# Altium project MiniPC MB GOST.PrjPcb (part 9 of 31)

## Sheet Supply Swithes 2V5-1V8.SchDoc
size 209 x 297 mm; Author: ALTIUM GOSTBOM2.0 KEV; SheetNumber: 46; SheetTotal: 48
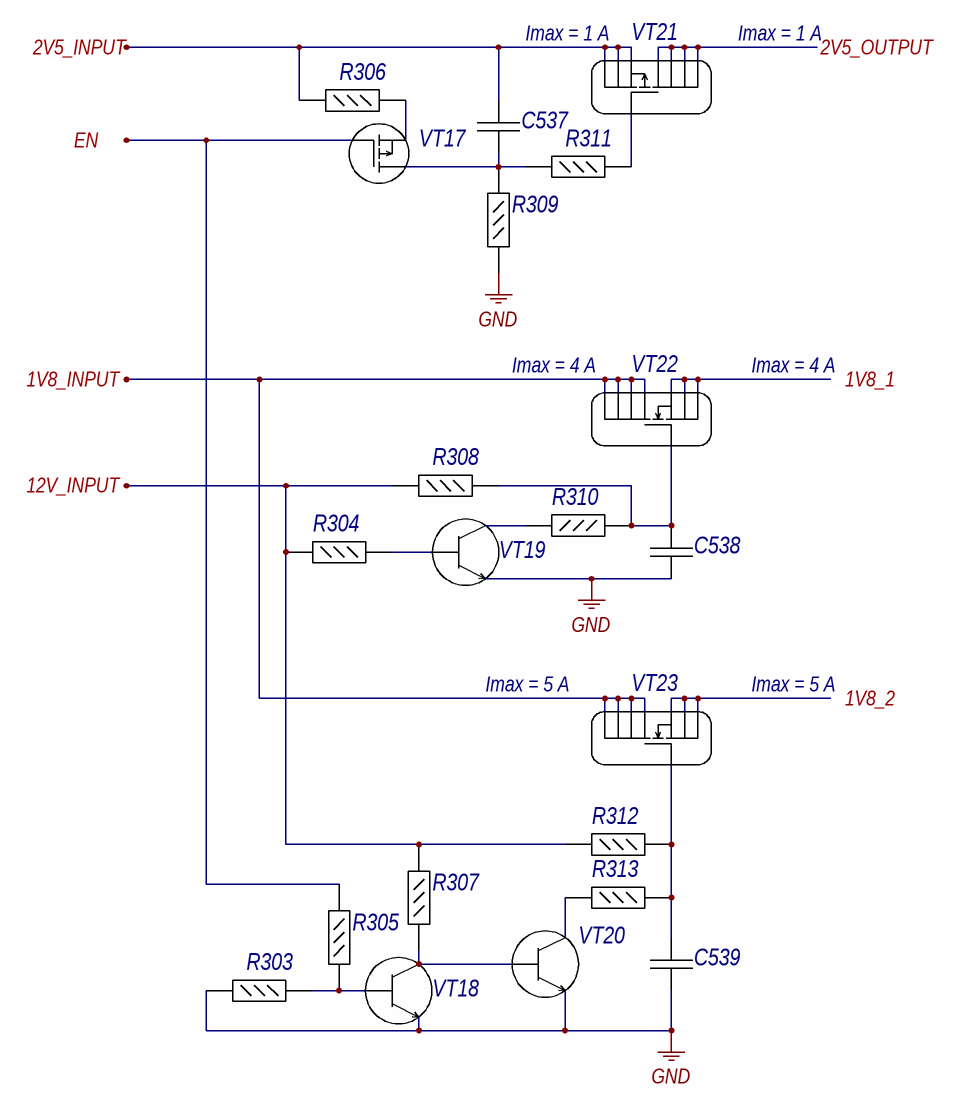
[diagram p11: Supply Swithes 2V5-1V8.SchDoc]

### Parts
C537  CGB2A1X5R1E105K033BC  [CAPC1005X33X10LL5]  (value not drawn)
C538  GRM155R71H103KA88D  [CAPC1005X55X25ML05T10]  (value not drawn)
C539  GRM155R71H103KA88D  [CAPC1005X55X25ML05T10]  (value not drawn)
R303  ERJ-2RKF1002X  [RESC1005X40X25LL05T05]  (value not drawn)
R304  ERJ-2RKF1003X  [RESC1005X40X25LL05T05]  (value not drawn)
R305  ERJ-2RKF1002X  [RESC1005X40X25LL05T05]  (value not drawn)
R306  ERJ-2RKF10R0X  [RESC1005X40X25LL05T05]  (value not drawn)
R307  ERJ-2RKF1003X  [RESC1005X40X25LL05T05]  (value not drawn)
R308  ERJ-2RKF1003X  [RESC1005X40X25LL05T05]  (value not drawn)
R309  ERJ-2RKF4992X  [RESC1005X40X25LL05T05]  (value not drawn)
R310  ERJ-2RKF1001X  [RESC1005X40X25LL05T05]  (value not drawn)
R311  ERJ-2RKF10R0X  [RESC1005X40X25LL05T05]  (value not drawn)
R312  ERJ-2RKF1003X  [RESC1005X40X25LL05T05]  (value not drawn)
R313  ERJ-2RKF1001X  [RESC1005X40X25LL05T05]  (value not drawn)
VT17  DMG2305UX-7  [DIOD-SOT23-3_A_V]  (value not drawn)
VT18  MMBT2222A-7-F  [DIOD-SOT23-3_V]  (value not drawn)
VT19  MMBT2222A-7-F  [DIOD-SOT23-3_V]  (value not drawn)
VT20  MMBT2222A-7-F  [DIOD-SOT23-3_V]  (value not drawn)
VT21  SiSS23DN-T1-GE3  [VISH-PPAK1212-8S_V]  (value not drawn)
VT22  SiRA00DP-T1-GE3  [VISH-PPAKSO-8_V]  (value not drawn)
VT23  SiRA00DP-T1-GE3  [VISH-PPAKSO-8_V]  (value not drawn)

### Ports
1V8_1, 1V8_2, 1V8_INPUT, 2V5_INPUT, 2V5_OUTPUT, 12V_INPUT, EN

### Nets
GND: C538.1 C539.1 R303.1 R309.1 VT18.2 VT19.2 VT20.2
12V_INPUT: R304.2 R307.2 R308.2 R312.2 ; port 12V_INPUT
IO_1V8: VT23.1(S) VT23.2(S) VT23.3(S) ; port 1V8_2
IO_2V5: VT21.5(D) VT21.6(D) VT21.7(D) VT21.8(D) ; port 2V5_OUTPUT
PLL_1V8: VT22.1(S) VT22.2(S) VT22.3(S) ; port 1V8_1
NetC437_2: VT22.5(D) VT22.6(D) VT22.7(D) VT22.8(D) VT23.5(D) VT23.6(D) VT23.7(D) VT23.8(D) ; port 1V8_INPUT
NetC537_1: C537.1 R309.2 R311.1 VT17.3
NetC537_2: C537.2 R306.2 VT21.1(S) VT21.2(S) VT21.3(S) ; port 2V5_INPUT
NetC538_2: C538.2 R308.1 R310.2 VT22.4(G)
NetC539_2: C539.2 R312.1 R313.2 VT23.4(G)
NetR188_2: R305.2 VT17.1 ; port EN
NetR303_2: R303.2 R305.1 VT18.1
NetR304_1: R304.1 VT19.1
NetR306_1: R306.1 VT17.2
NetR307_1: R307.1 VT18.3 VT20.1
NetR310_1: R310.1 VT19.3
NetR311_2: R311.2 VT21.4(G)
NetR313_1: R313.1 VT20.3

### Notes on the sheet
- (near VT21) Imax = 1 А
- Imax = 1 А
- (near VT22) Imax = 4 А
- Imax = 4 А
- (near VT23) Imax = 5 А
- Imax = 5 А
- Подп. дата
- Инв. № дубл.
- Взам. инв. №
- Подп. и дата
- Инв. № подл.
- Изм.
- Лист
- № докум.
- Подп.
- Дата
- Файл:
- ALTIUM GOSTBOM2.0 KEV
- Копировал
- Формат А4

### Library data of the parts
C537 = E2: Chip Capacitor, 1 uF, +/- 10%, 25 V, -55 to 85 degC, 0402 (1005 Metric), RoHS, Tape and Reel; Тип элемента: Конденсатор; Capacitance: 1 uF; Old_des: C1; New_des: C537; UID: E2; Component Kind: Standard; Case Code (Imperial): 0402; Case Code (Metric): 1005; Case/Package: 0402; ComponentLink1Description: Manufacturer URL; ComponentLink1URL: http://www.tdk.com/; ComponentLink2Description: Datasheet; ComponentLink2URL: https://product.tdk.com/info/en/catalog/datasheets/mlcc_commercial_lowprofile_en.pdf; DatasheetVersion: 04/2015; Length: 0.039 inch; Max Operating Temperature: 85 degC; Min Operating Temperature: -55 degC; Mounting Technology: Surface Mount; Package Quantity: 1; PackageDescription: 2-Pin Surface Mount Device, Body 1 x 0.5 mm; Packaging: Tape and Reel; PartNumber: CGB2A1X5R1E105K033BC; RoHSCompliant: True; Tolerance: 10%; Width: 0.02 inch
C538 = E3: Chip Capacitor, 10 nF, +/- 10%, 50 V, -55 to 125 degC, 0402 (1005 Metric), RoHS, Tape and Reel; Manufacturer: Basic Passives; Тип элемента: Конденсатор; Capacitance: 10 nF; Case\/Package: 0402; Type (Capacitors): X7R; Voltage Rating: 50 V; Old_des: C3; New_des: C538; UID: E3; Component Kind: Standard; Case Code (Imperial): 0402; Case Code (Metric): 1005; ComponentLink1Description: Manufacturer URL; ComponentLink1URL: http://www.murata.com/; ComponentLink2Description: Datasheet; ComponentLink2URL: http://search.murata.co.jp/Ceramy/image/img/A01X/G101/ENG/GRM155R71H103KA88-01.pdf; DatasheetVersion: 02/2016; Length: 1 mm; Max Operating Temperature: 125 degC; Min Operating Temperature: -55 degC; Mounting Technology: Surface Mount; Package Quantity: 10000; PackageDescription: 2-Pin Surface Mount Device, Body 1 x 0.5 mm; Packaging: Tape and Reel; PartNumber: GRM155R71H103KA88D; RoHSCompliant: true; Tolerance: 10%; Width: 0.5 mm; Height: 0.5 mm; Lead Pitch: 2mm; Mount: Surface Mount; PackageReference: 0402; Pins: 2; Radiation Hardening: No; REACH SVHC: No SVHC; Voltage Rating (DC): 50 V
C539 = E3: Chip Capacitor, 10 nF, +/- 10%, 50 V, -55 to 125 degC, 0402 (1005 Metric), RoHS, Tape and Reel; Manufacturer: Basic Passives; Тип элемента: Конденсатор; Capacitance: 10 nF; Case\/Package: 0402; Type (Capacitors): X7R; Voltage Rating: 50 V; Old_des: C2; New_des: C539; UID: E3; Component Kind: Standard; Case Code (Imperial): 0402; Case Code (Metric): 1005; ComponentLink1Description: Manufacturer URL; ComponentLink1URL: http://www.murata.com/; ComponentLink2Description: Datasheet; ComponentLink2URL: http://search.murata.co.jp/Ceramy/image/img/A01X/G101/ENG/GRM155R71H103KA88-01.pdf; DatasheetVersion: 02/2016; Length: 1 mm; Max Operating Temperature: 125 degC; Min Operating Temperature: -55 degC; Mounting Technology: Surface Mount; Package Quantity: 10000; PackageDescription: 2-Pin Surface Mount Device, Body 1 x 0.5 mm; Packaging: Tape and Reel; PartNumber: GRM155R71H103KA88D; RoHSCompliant: true; Tolerance: 10%; Width: 0.5 mm; Height: 0.5 mm; Lead Pitch: 2mm; Mount: Surface Mount; PackageReference: 0402; Pins: 2; Radiation Hardening: No; REACH SVHC: No SVHC; Voltage Rating (DC): 50 V
R303 = E60: Chip Resistor, 10 KOhm, +/- 1%, 100 mW, -55 to 155 degC, 0402 (1005 Metric), RoHS, Tape and Reel; Manufacturer: Basic Passives; Тип элемента: Резистор; Case\/Package: 0402; Voltage Rating: 50 V; Power Rating: 100 mW; Resistance: 10 KOhm; Old_des: R9; New_des: R303; UID: E60; Component Kind: Standard; Case Code (Imperial): 0402; Case Code (Metric): 1005; ComponentLink1Description: Manufacturer URL; ComponentLink1URL: http://www.panasonic.com/; ComponentLink2Description: Datasheet; ComponentLink2URL: http://industrial.panasonic.com/cdbs/www-data/pdf/RDA0000/AOA0000C86.pdf; DatasheetVersion: 04/2015; Length: 1 mm; Max Operating Temperature: 155 degC; Min Operating Temperature: -55 degC; Mounting Technology: Surface Mount; Package Quantity: 10000; PackageDescription: 2-Pin Surface Mount Device, Body 1 x 0.5 mm; Packaging: Tape and Reel; PartNumber: ERJ-2RKF1002X; RoHSCompliant: true; Tolerance: 1%; Width: 0.5 mm; Height: 0.35 mm; Mount: Surface Mount; PackageReference: 0402; Pins: 2; Radiation Hardening: No; REACH SVHC: Yes
R304 = E58: Chip Resistor, 100 KOhm, +/- 1%, 100 mW, -55 to 155 degC, 0402 (1005 Metric), RoHS, Tape and Reel; Manufacturer: Basic Passives; Тип элемента: Резистор; Case\/Package: 0402; Voltage Rating: 50 V; Power Rating: 100 mW; Old_des: R10; New_des: R304; UID: E58; Component Kind: Standard; Case Code (Imperial): 0402; Case Code (Metric): 1005; ComponentLink1Description: Manufacturer URL; ComponentLink1URL: http://www.panasonic.com/; ComponentLink2Description: Datasheet; ComponentLink2URL: http://industrial.panasonic.com/cdbs/www-data/pdf/RDA0000/AOA0000C86.pdf; DatasheetVersion: 04/2015; Length: 1 mm; Max Operating Temperature: 155 degC; Min Operating Temperature: -55 degC; Mounting Technology: Surface Mount; Package Quantity: 10000; PackageDescription: 2-Pin Surface Mount Device, Body 1 x 0.5 mm; Packaging: Tape and Reel; PartNumber: ERJ-2RKF1003X; RoHSCompliant: true; Tolerance: 1%; Width: 0.5 mm; Height: 0.35 mm; Mount: Surface Mount; PackageReference: 0402; Pins: 2; Radiation Hardening: No; REACH SVHC: Yes; Resistance: 100 KOhm
R305 = E60: Chip Resistor, 10 KOhm, +/- 1%, 100 mW, -55 to 155 degC, 0402 (1005 Metric), RoHS, Tape and Reel; Manufacturer: Basic Passives; Тип элемента: Резистор; Case\/Package: 0402; Voltage Rating: 50 V; Power Rating: 100 mW; Resistance: 10 KOhm; Old_des: R7; New_des: R305; UID: E60; Component Kind: Standard; Case Code (Imperial): 0402; Case Code (Metric): 1005; ComponentLink1Description: Manufacturer URL; ComponentLink1URL: http://www.panasonic.com/; ComponentLink2Description: Datasheet; ComponentLink2URL: http://industrial.panasonic.com/cdbs/www-data/pdf/RDA0000/AOA0000C86.pdf; DatasheetVersion: 04/2015; Length: 1 mm; Max Operating Temperature: 155 degC; Min Operating Temperature: -55 degC; Mounting Technology: Surface Mount; Package Quantity: 10000; PackageDescription: 2-Pin Surface Mount Device, Body 1 x 0.5 mm; Packaging: Tape and Reel; PartNumber: ERJ-2RKF1002X; RoHSCompliant: true; Tolerance: 1%; Width: 0.5 mm; Height: 0.35 mm; Mount: Surface Mount; PackageReference: 0402; Pins: 2; Radiation Hardening: No; REACH SVHC: Yes
R306 = E56: Chip Resistor, 10 Ohm, +/- 1%, 100 mW, -55 to 155 degC, 0402 (1005 Metric), RoHS, Tape and Reel; Manufacturer: Basic Passives; Тип элемента: Резистор; Case\/Package: 0402; Voltage Rating: 50 V; Power Rating: 100 mW; Resistance: 10 Ohm; Old_des: R1; New_des: R306; UID: E56; Component Kind: Standard; Case Code (Imperial): 0402; Case Code (Metric): 1005; ComponentLink1Description: Manufacturer URL; ComponentLink1URL: http://www.panasonic.com/; ComponentLink2Description: Datasheet; ComponentLink2URL: http://industrial.panasonic.com/cdbs/www-data/pdf/RDA0000/AOA0000C86.pdf; DatasheetVersion: 04/2015; Length: 1 mm; Max Operating Temperature: 155 degC; Min Operating Temperature: -55 degC; Mounting Technology: Surface Mount; Package Quantity: 10000; PackageDescription: 2-Pin Surface Mount Device, Body 1 x 0.5 mm; Packaging: Tape and Reel; PartNumber: ERJ-2RKF10R0X; RoHSCompliant: true; Tolerance: 1%; Width: 0.5 mm; Height: 0.35 mm; Mount: Surface Mount; PackageReference: 0402; Pins: 2; Radiation Hardening: No; REACH SVHC: Yes
R307 = E58: Chip Resistor, 100 KOhm, +/- 1%, 100 mW, -55 to 155 degC, 0402 (1005 Metric), RoHS, Tape and Reel; Manufacturer: Basic Passives; Тип элемента: Резистор; Case\/Package: 0402; Voltage Rating: 50 V; Power Rating: 100 mW; Old_des: R4; New_des: R307; UID: E58; Component Kind: Standard; Case Code (Imperial): 0402; Case Code (Metric): 1005; ComponentLink1Description: Manufacturer URL; ComponentLink1URL: http://www.panasonic.com/; ComponentLink2Description: Datasheet; ComponentLink2URL: http://industrial.panasonic.com/cdbs/www-data/pdf/RDA0000/AOA0000C86.pdf; DatasheetVersion: 04/2015; Length: 1 mm; Max Operating Temperature: 155 degC; Min Operating Temperature: -55 degC; Mounting Technology: Surface Mount; Package Quantity: 10000; PackageDescription: 2-Pin Surface Mount Device, Body 1 x 0.5 mm; Packaging: Tape and Reel; PartNumber: ERJ-2RKF1003X; RoHSCompliant: true; Tolerance: 1%; Width: 0.5 mm; Height: 0.35 mm; Mount: Surface Mount; PackageReference: 0402; Pins: 2; Radiation Hardening: No; REACH SVHC: Yes; Resistance: 100 KOhm
R308 = E58: Chip Resistor, 100 KOhm, +/- 1%, 100 mW, -55 to 155 degC, 0402 (1005 Metric), RoHS, Tape and Reel; Manufacturer: Basic Passives; Тип элемента: Резистор; Case\/Package: 0402; Voltage Rating: 50 V; Power Rating: 100 mW; Old_des: R8; New_des: R308; UID: E58; Component Kind: Standard; Case Code (Imperial): 0402; Case Code (Metric): 1005; ComponentLink1Description: Manufacturer URL; ComponentLink1URL: http://www.panasonic.com/; ComponentLink2Description: Datasheet; ComponentLink2URL: http://industrial.panasonic.com/cdbs/www-data/pdf/RDA0000/AOA0000C86.pdf; DatasheetVersion: 04/2015; Length: 1 mm; Max Operating Temperature: 155 degC; Min Operating Temperature: -55 degC; Mounting Technology: Surface Mount; Package Quantity: 10000; PackageDescription: 2-Pin Surface Mount Device, Body 1 x 0.5 mm; Packaging: Tape and Reel; PartNumber: ERJ-2RKF1003X; RoHSCompliant: true; Tolerance: 1%; Width: 0.5 mm; Height: 0.35 mm; Mount: Surface Mount; PackageReference: 0402; Pins: 2; Radiation Hardening: No; REACH SVHC: Yes; Resistance: 100 KOhm
R309 = E57: Chip Resistor, 49.9 KOhm, +/- 1%, 100 mW, -55 to 155 degC, 0402 (1005 Metric), RoHS, Tape and Reel; Manufacturer: Basic Passives; Тип элемента: Резистор; Case\/Package: 0402; Voltage Rating: 50 V; Power Rating: 100 mW; Old_des: R3; New_des: R309; UID: E57; Component Kind: Standard; Case Code (Imperial): 0402; Case Code (Metric): 1005; ComponentLink1Description: Manufacturer URL; ComponentLink1URL: http://www.panasonic.com/; ComponentLink2Description: Datasheet; ComponentLink2URL: http://industrial.panasonic.com/cdbs/www-data/pdf/RDA0000/AOA0000C86.pdf; DatasheetVersion: 04/2015; Length: 1 mm; Max Operating Temperature: 155 degC; Min Operating Temperature: -55 degC; Mounting Technology: Surface Mount; Package Quantity: 10000; PackageDescription: 2-Pin Surface Mount Device, Body 1 x 0.5 mm; Packaging: Tape and Reel; PartNumber: ERJ-2RKF4992X; RoHSCompliant: true; Tolerance: 1%; Width: 0.5 mm; Height: 0.35 mm; Mount: Surface Mount; PackageReference: 0402; Pins: 2; Radiation Hardening: No; REACH SVHC: No SVHC; Resistance: 49.9 KOhm
R310 = E59: Chip Resistor, 1 KOhm, +/- 1%, 100 mW, -55 to 155 degC, 0402 (1005 Metric), RoHS, Tape and Reel; Manufacturer: Basic Passives; Тип элемента: Резистор; Case\/Package: 0402; Voltage Rating: 50 V; Power Rating: 100 mW; Resistance: 1 KOhm; Old_des: R11; New_des: R311; UID: E59; Component Kind: Standard; Case Code (Imperial): 0402; Case Code (Metric): 1005; ComponentLink1Description: Manufacturer URL; ComponentLink1URL: http://www.panasonic.com/; ComponentLink2Description: Datasheet; ComponentLink2URL: http://industrial.panasonic.com/cdbs/www-data/pdf/RDA0000/AOA0000C86.pdf; DatasheetVersion: 04/2015; Length: 1 mm; Max Operating Temperature: 155 degC; Min Operating Temperature: -55 degC; Mounting Technology: Surface Mount; Package Quantity: 10000; PackageDescription: 2-Pin Surface Mount Device, Body 1 x 0.5 mm; Packaging: Tape and Reel; PartNumber: ERJ-2RKF1001X; RoHSCompliant: true; Tolerance: 1%; Width: 0.5 mm; Height: 0.35 mm; Mount: Surface Mount; PackageReference: 0402; Pins: 2; Radiation Hardening: No; REACH SVHC: Yes
R311 = E56: Chip Resistor, 10 Ohm, +/- 1%, 100 mW, -55 to 155 degC, 0402 (1005 Metric), RoHS, Tape and Reel; Manufacturer: Basic Passives; Тип элемента: Резистор; Case\/Package: 0402; Voltage Rating: 50 V; Power Rating: 100 mW; Resistance: 10 Ohm; Old_des: R2; New_des: R310; UID: E56; Component Kind: Standard; Case Code (Imperial): 0402; Case Code (Metric): 1005; ComponentLink1Description: Manufacturer URL; ComponentLink1URL: http://www.panasonic.com/; ComponentLink2Description: Datasheet; ComponentLink2URL: http://industrial.panasonic.com/cdbs/www-data/pdf/RDA0000/AOA0000C86.pdf; DatasheetVersion: 04/2015; Length: 1 mm; Max Operating Temperature: 155 degC; Min Operating Temperature: -55 degC; Mounting Technology: Surface Mount; Package Quantity: 10000; PackageDescription: 2-Pin Surface Mount Device, Body 1 x 0.5 mm; Packaging: Tape and Reel; PartNumber: ERJ-2RKF10R0X; RoHSCompliant: true; Tolerance: 1%; Width: 0.5 mm; Height: 0.35 mm; Mount: Surface Mount; PackageReference: 0402; Pins: 2; Radiation Hardening: No; REACH SVHC: Yes
R312 = E58: Chip Resistor, 100 KOhm, +/- 1%, 100 mW, -55 to 155 degC, 0402 (1005 Metric), RoHS, Tape and Reel; Manufacturer: Basic Passives; Тип элемента: Резистор; Case\/Package: 0402; Voltage Rating: 50 V; Power Rating: 100 mW; Old_des: R5; New_des: R312; UID: E58; Component Kind: Standard; Case Code (Imperial): 0402; Case Code (Metric): 1005; ComponentLink1Description: Manufacturer URL; ComponentLink1URL: http://www.panasonic.com/; ComponentLink2Description: Datasheet; ComponentLink2URL: http://industrial.panasonic.com/cdbs/www-data/pdf/RDA0000/AOA0000C86.pdf; DatasheetVersion: 04/2015; Length: 1 mm; Max Operating Temperature: 155 degC; Min Operating Temperature: -55 degC; Mounting Technology: Surface Mount; Package Quantity: 10000; PackageDescription: 2-Pin Surface Mount Device, Body 1 x 0.5 mm; Packaging: Tape and Reel; PartNumber: ERJ-2RKF1003X; RoHSCompliant: true; Tolerance: 1%; Width: 0.5 mm; Height: 0.35 mm; Mount: Surface Mount; PackageReference: 0402; Pins: 2; Radiation Hardening: No; REACH SVHC: Yes; Resistance: 100 KOhm
R313 = E59: Chip Resistor, 1 KOhm, +/- 1%, 100 mW, -55 to 155 degC, 0402 (1005 Metric), RoHS, Tape and Reel; Manufacturer: Basic Passives; Тип элемента: Резистор; Case\/Package: 0402; Voltage Rating: 50 V; Power Rating: 100 mW; Resistance: 1 KOhm; Old_des: R6; New_des: R313; UID: E59; Component Kind: Standard; Case Code (Imperial): 0402; Case Code (Metric): 1005; ComponentLink1Description: Manufacturer URL; ComponentLink1URL: http://www.panasonic.com/; ComponentLink2Description: Datasheet; ComponentLink2URL: http://industrial.panasonic.com/cdbs/www-data/pdf/RDA0000/AOA0000C86.pdf; DatasheetVersion: 04/2015; Length: 1 mm; Max Operating Temperature: 155 degC; Min Operating Temperature: -55 degC; Mounting Technology: Surface Mount; Package Quantity: 10000; PackageDescription: 2-Pin Surface Mount Device, Body 1 x 0.5 mm; Packaging: Tape and Reel; PartNumber: ERJ-2RKF1001X; RoHSCompliant: true; Tolerance: 1%; Width: 0.5 mm; Height: 0.35 mm; Mount: Surface Mount; PackageReference: 0402; Pins: 2; Radiation Hardening: No; REACH SVHC: Yes
VT17 = E51: P-Channel Enhancement Mode MOSFET, 20 V, -55 to 150 degC, 3-Pin SOT23, RoHS, Tape and Reel; Manufacturer: Diodes Inc; Тип элемента: МДП-транзистор, индуцированный P канал; Old_des: Q2; New_des: VT17; UID: E51; Component Kind: Standard; ComponentLink1Description: Manufacturer URL; ComponentLink1URL: http://www.diodes.com/; ComponentLink2Description: Datasheet; ComponentLink2URL: http://www.diodes.com/_files/datasheets/DMG2305UX.pdf; DatasheetVersion: Rev. 5-2; Mounting Technology: Surface Mount; PackageDescription: 3-Pin Small Outline Transistor, Body 2.9 x 1.3 mm, Pitch 0.915 mm; PartNumber: DMG2305UX-7; PackageReference: SOT23-3
VT18 = E53: NPN Small Signal Transistor, 40 V, -55 to 150 degC, 3-Pin SOT23, RoHS, Tape and Reel; Manufacturer: Diodes Inc; Тип элемента: NPN-транзистор; Old_des: Q6; New_des: VT18; UID: E53; Component Kind: Standard; ComponentLink1Description: Manufacturer URL; ComponentLink1URL: http://www.diodes.com/; ComponentLink2Description: Datasheet; ComponentLink2URL: http://www.diodes.com/_files/datasheets/ds30041.pdf; DatasheetVersion: Rev. 16 - 2; Mounting Technology: Surface Mount; PackageDescription: 3-Pin Small Outline Transistor, Body 2.9 x 1.3 mm, Pitch 0.95 mm; PartNumber: MMBT2222A-7-F; PackageReference: SOT23-3
VT19 = E53: NPN Small Signal Transistor, 40 V, -55 to 150 degC, 3-Pin SOT23, RoHS, Tape and Reel; Manufacturer: Diodes Inc; Тип элемента: NPN-транзистор; Old_des: Q7; New_des: VT19; UID: E53; Component Kind: Standard; ComponentLink1Description: Manufacturer URL; ComponentLink1URL: http://www.diodes.com/; ComponentLink2Description: Datasheet; ComponentLink2URL: http://www.diodes.com/_files/datasheets/ds30041.pdf; DatasheetVersion: Rev. 16 - 2; Mounting Technology: Surface Mount; PackageDescription: 3-Pin Small Outline Transistor, Body 2.9 x 1.3 mm, Pitch 0.95 mm; PartNumber: MMBT2222A-7-F; PackageReference: SOT23-3
VT20 = E53: NPN Small Signal Transistor, 40 V, -55 to 150 degC, 3-Pin SOT23, RoHS, Tape and Reel; Manufacturer: Diodes Inc; Тип элемента: NPN-транзистор; Old_des: Q5; New_des: VT20; UID: E53; Component Kind: Standard; ComponentLink1Description: Manufacturer URL; ComponentLink1URL: http://www.diodes.com/; ComponentLink2Description: Datasheet; ComponentLink2URL: http://www.diodes.com/_files/datasheets/ds30041.pdf; DatasheetVersion: Rev. 16 - 2; Mounting Technology: Surface Mount; PackageDescription: 3-Pin Small Outline Transistor, Body 2.9 x 1.3 mm, Pitch 0.95 mm; PartNumber: MMBT2222A-7-F; PackageReference: SOT23-3
VT21 = E50: P-Channel MOSFET, 20 V, -50 to 150 degC, 8-Pin SMD (PPAK1212-8S), RoHS, Tape and Reel; Тип элемента: МДП-транзистор, индуцированный P канал; Old_des: Q1; New_des: VT21; UID: E50; Component Kind: Standard; ComponentLink1Description: Manufacturer URL; ComponentLink1URL: http://www.vishay.com/; ComponentLink2Description: Datasheet; ComponentLink2URL: http://www.vishay.com/docs/62852/siss23dn.pdf; DatasheetVersion: Rev. A; Mounting Technology: Surface Mount; PackageDescription: 8-Pin Surface Mount Device, Body 3.3 x 3.3 mm, Pitch 0.66 mm; PartNumber: SiSS23DN-T1-GE3; ComponentLink3Description: Package Specification; ComponentLink3URL: http://www.vishay.com/docs/63919/caseoutl.pdf; PackageVersion: Rev. A, 03/2012
VT22 = E52: N-Channe MOSFET, 30 V, -55 to 150 degC, 8-Pin SMD (PPAKSO-8), RoHS, Tape and Reel; Тип элемента: МДП-транзистор, индуцированный N канал; Old_des: Q4; New_des: VT22; UID: E52; Component Kind: Standard; Case/Package: SOIC; ComponentLink1Description: Manufacturer URL; ComponentLink1URL: http://www.vishay.com/; ComponentLink2Description: Datasheet; ComponentLink2URL: http://www.vishay.com/docs/63780/sira00dp.pdf; DatasheetVersion: Rev. B; Length: 5.99 mm; Max Operating Temperature: 150 degC; Min Operating Temperature: -55 degC; Mounting Technology: Surface Mount; Package Quantity: 1; PackageDescription: 8-Pin Surface Mount Device, Body 4.9 x 5.89 mm, Pitch 1.27 mm; Packaging: Tape and Reel; PartNumber: SiRA00DP-T1-GE3; RoHSCompliant: True; Width: 5 mm; Height: 1.07 mm; Mount: Surface Mount; Pins: 8; Radiation Hardening: No; REACH SVHC: Unknown
VT23 = E52: N-Channe MOSFET, 30 V, -55 to 150 degC, 8-Pin SMD (PPAKSO-8), RoHS, Tape and Reel; Тип элемента: МДП-транзистор, индуцированный N канал; Old_des: Q3; New_des: VT23; UID: E52; Component Kind: Standard; Case/Package: SOIC; ComponentLink1Description: Manufacturer URL; ComponentLink1URL: http://www.vishay.com/; ComponentLink2Description: Datasheet; ComponentLink2URL: http://www.vishay.com/docs/63780/sira00dp.pdf; DatasheetVersion: Rev. B; Length: 5.99 mm; Max Operating Temperature: 150 degC; Min Operating Temperature: -55 degC; Mounting Technology: Surface Mount; Package Quantity: 1; PackageDescription: 8-Pin Surface Mount Device, Body 4.9 x 5.89 mm, Pitch 1.27 mm; Packaging: Tape and Reel; PartNumber: SiRA00DP-T1-GE3; RoHSCompliant: True; Width: 5 mm; Height: 1.07 mm; Mount: Surface Mount; Pins: 8; Radiation Hardening: No; REACH SVHC: Unknown